# Altium schematic sheet Zero Crossing.SchDoc
size 215 x 83 mm; PageSetup: Record=PageOptions|CenterHorizontal=True|CenterVertical=True|PrintScale=0.71|XCorrection=1.00|YCorrection=1.00|PrintKind=1|BorderSize=5000000|LeftOffset=0|BottomOffset=0|Orientation=2|PaperLength=1000|PaperWidth=1000|Scale=100|PaperSource=15|PrintQuality=4000|MediaType=1|DitherType=10|PrintScaleMode=1|PaperKind=A4|PaperIndex=9
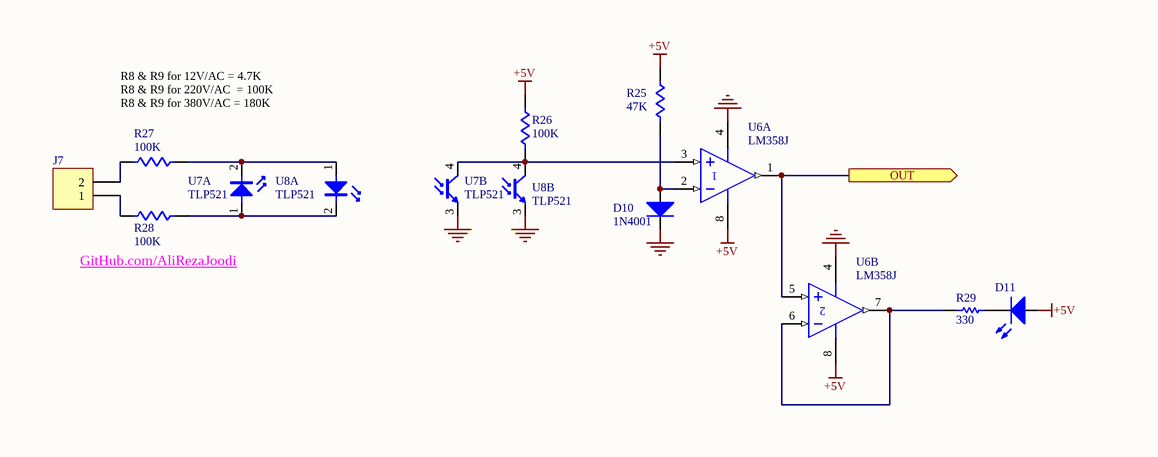
[diagram p0: Zero Crossing.SchDoc]

## Parts
D10  1N4001  [DIODE-0.4]
D11  LED  [LED-5mm_Red]  (value not drawn)
J7  Header 2  [Fonics_2PIN_1]  (value not drawn)
R25  value 47K  [AXIAL-0.4]  (hidden comment: Res1)
R26  value 100K  [AXIAL-0.4]  (hidden comment: Res1)
R27  value 100K  [AXIAL-0.4]  (hidden comment: Res1)
R28  value 100K  [AXIAL-0.4]  (hidden comment: Res1)
R29  value 330  [AXIAL-0.4]  (hidden comment: Resistor)
U6  LM358J  [693-02]  (parts A,B of 2)
U7  value TLP521  [DIP-4]  (hidden comment: Optoisolator)  (parts A,B of 2)
U8  value TLP521  [DIP-4]  (hidden comment: Optoisolator)  (parts A,B of 2)

## Ports
OUT (out)

## Nets
+5V: D11.1(A) R25.1 R26.1 U6.8(V+)
GND: D10.2(K) U6.4(V-) U7.3(E) U8.3(E)
OUT: U6.1(OUT) U6.5(IN+) ; port OUT
NetD10_1: D10.1(A) R25.2 U6.2(IN-)
NetD11_2: D11.2(K) R29.1
NetJ7_1: J7.1 R28.1
NetJ7_2: J7.2 R27.1
NetR26_2: R26.2 U6.3(IN+) U7.4(C) U8.4(C)
NetR27_2: R27.2 U7.2(K) U8.1(A)
NetR28_2: R28.2 U7.1(A) U8.2(K)
NetR29_2: R29.2 U6.6(IN-) U6.7(OUT)

## Notes on the sheet
- R8 & R9 for 12V/AC = 4.7K
  R8 & R9 for 220V/AC  = 100K
  R8 & R9 for 380V/AC = 180K
- GitHub.com/AliRezaJoodi

## Library data of the parts
D10 = Diode: Default Diode; Manufacturer: Generic Components; Class I: Discrete; Class II: Diode - Switching; Published: 8-Jun-2000; Revision: July-2002: Re-released for DXP Platform.; Publisher: Altium Limited
D11 = LED: Typical INFRARED GaAs LED; Manufacturer: Generic Components; Class I: Optoelectronic; Published: 8-Jun-2000; Revision: July-2002: Re-released for DXP Platform.; Publisher: Altium Limited; Class II: LED
J7 = Header 2: Header, 2-Pin; LatestRevisionDate: 17-Jul-2002; LatestRevisionNote: Re-released for DXP Platform.; Publisher: Altium Limited
R25-R28 = Res1: Resistor; Manufacturer: Generic Components; Class I: Passive; Published: 8-Jun-2000; Revision: July-2002: Re-released for DXP Platform.; Publisher: Altium Limited; Class II: Resistor
R29 = Res1: Manufacturer: Generic Components; Class I: Passive; Published: 8-Jun-2000; Revision: July-2002: Re-released for DXP Platform.; Publisher: Altium Limited; Class II: Resistor
U6 = LM358J: Dual Low-Power Operational Amplifier; Published: 17-Jul-2002; LatestRevisionDate: 06-Jun-2005; LatestRevisionNote: Stylized 3D Model Added.; DatasheetVersion: 1988; PackageReference: 693-02; Publisher: Altium Limited; PackageDescription: DIP; 8 Leads; Row Spacing 7.62 mm; Pitch 2.54 mm; Code_JEDEC: MO-001-AN; ComponentLink1Description: Manufacturer Link; ComponentLink1URL: http://www.onsemi.com/site/products/parametrics/0,4446,251,00.html; ComponentLink2Description: Datasheet; ComponentLink2URL: http://www.onsemi.com/pub/Collateral/LM358-D.PDF
U7 U8 = Optoisolator: Publisher: Altium Limited